# EAGLE schematic SWITCHCONTROLLER (EAGLE 9.4.2)

## Sheet 1 of 4
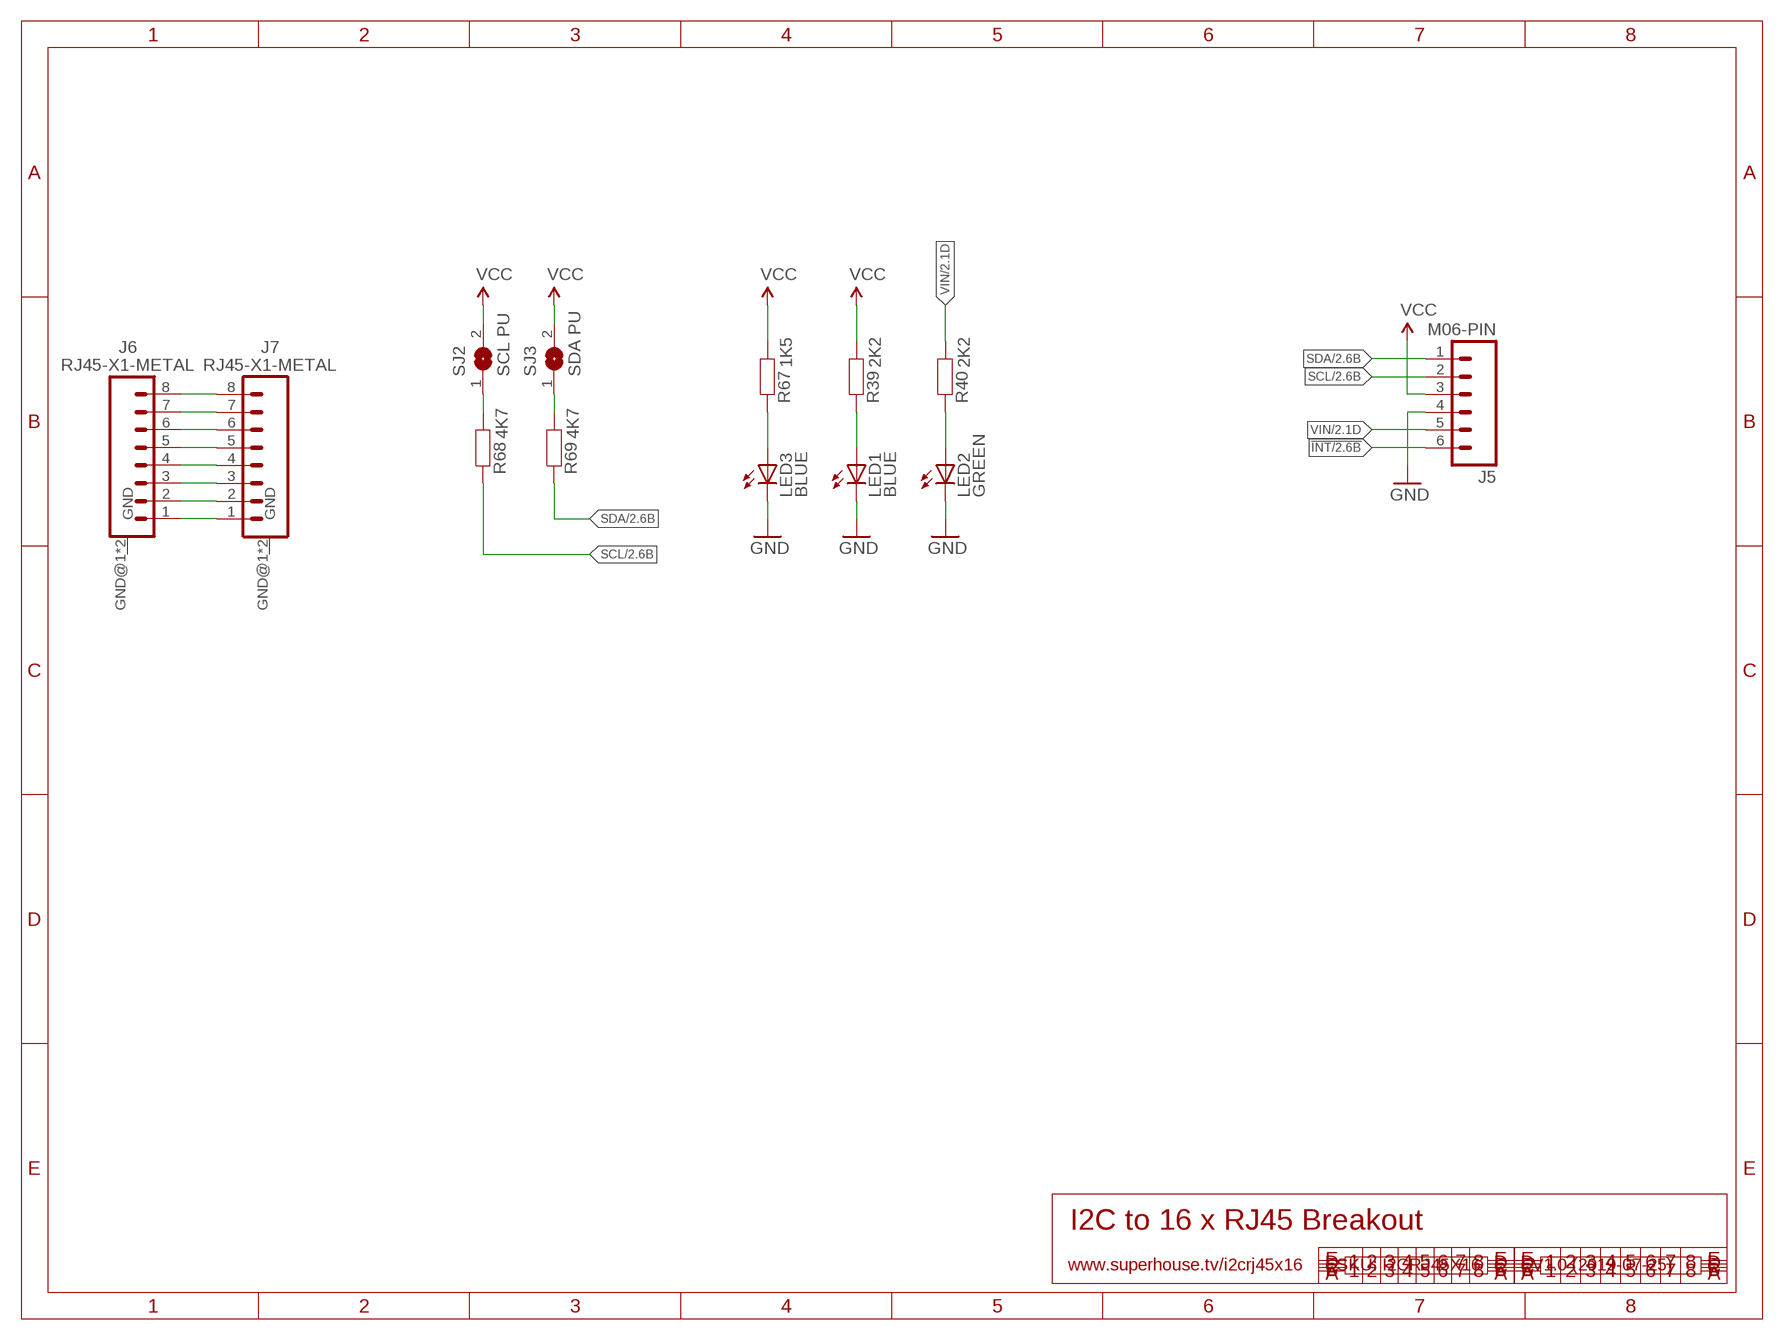
[diagram p0: schematic, sheet 1]

### Parts
J5  M06-PIN  [1X06-P]
J6  RJ45-X1-METAL  [RJ45-1X1]
J7  RJ45-X1-METAL  [RJ45-1X1]
LED1  BLUE  LED0603  [LED-0603]
LED2  GREEN  LED0603  [LED-0603]
LED3  BLUE  LED3MM  [LED3MM]
R39  2K2  RESISTOR0603  [R0603]
R40  2K2  RESISTOR0603  [R0603]
R67  1K5  RESISTOR0603  [R0603]
R68  4K7  RESISTOR0603  [R0603]
R69  4K7  RESISTOR0603  [R0603]
SJ2  SCL PU  SJ-NORMAL  [SJ]
SJ3  SDA PU  SJ-NORMAL  [SJ]

### Nets
!INT: J5.6 ; also sheet 2,3,4
GND: J5.4 LED1.C LED2.C LED3.K(C) ; also sheet 2,3,4
N$1: R68.2 SJ2.1
N$2: R69.2 SJ3.1
N$3: J6.1 J7.1
N$4: J6.2 J7.2
N$5: J6.3 J7.3
N$6: J6.4 J7.4
N$7: LED1.A R39.1
N$8: LED2.A R40.1
N$9: J6.5 J7.5
N$10: J6.6 J7.6
N$11: J6.7 J7.7
N$12: J6.8 J7.8
N$13: LED3.A R67.1
SCL: J5.2 R68.1 ; also sheet 2,3,4
SDA: J5.1 R69.1 ; also sheet 2,3,4
VCC: J5.3 R39.2 R67.2 SJ2.2 SJ3.2 ; also sheet 2,3,4
VIN: J5.5 R40.2 ; also sheet 2,3,4
Unconnected: J6.GND@1(GND) J6.GND@2(GND) J7.GND@1(GND) J7.GND@2(GND)

### Notes on the sheet
- I2C to 16 x RJ45 Breakout
- www.superhouse.tv/i2crj45x16 | SKU: I2CRJ45X16 | V1.0 (2019-07-25)

## Sheet 2 of 4
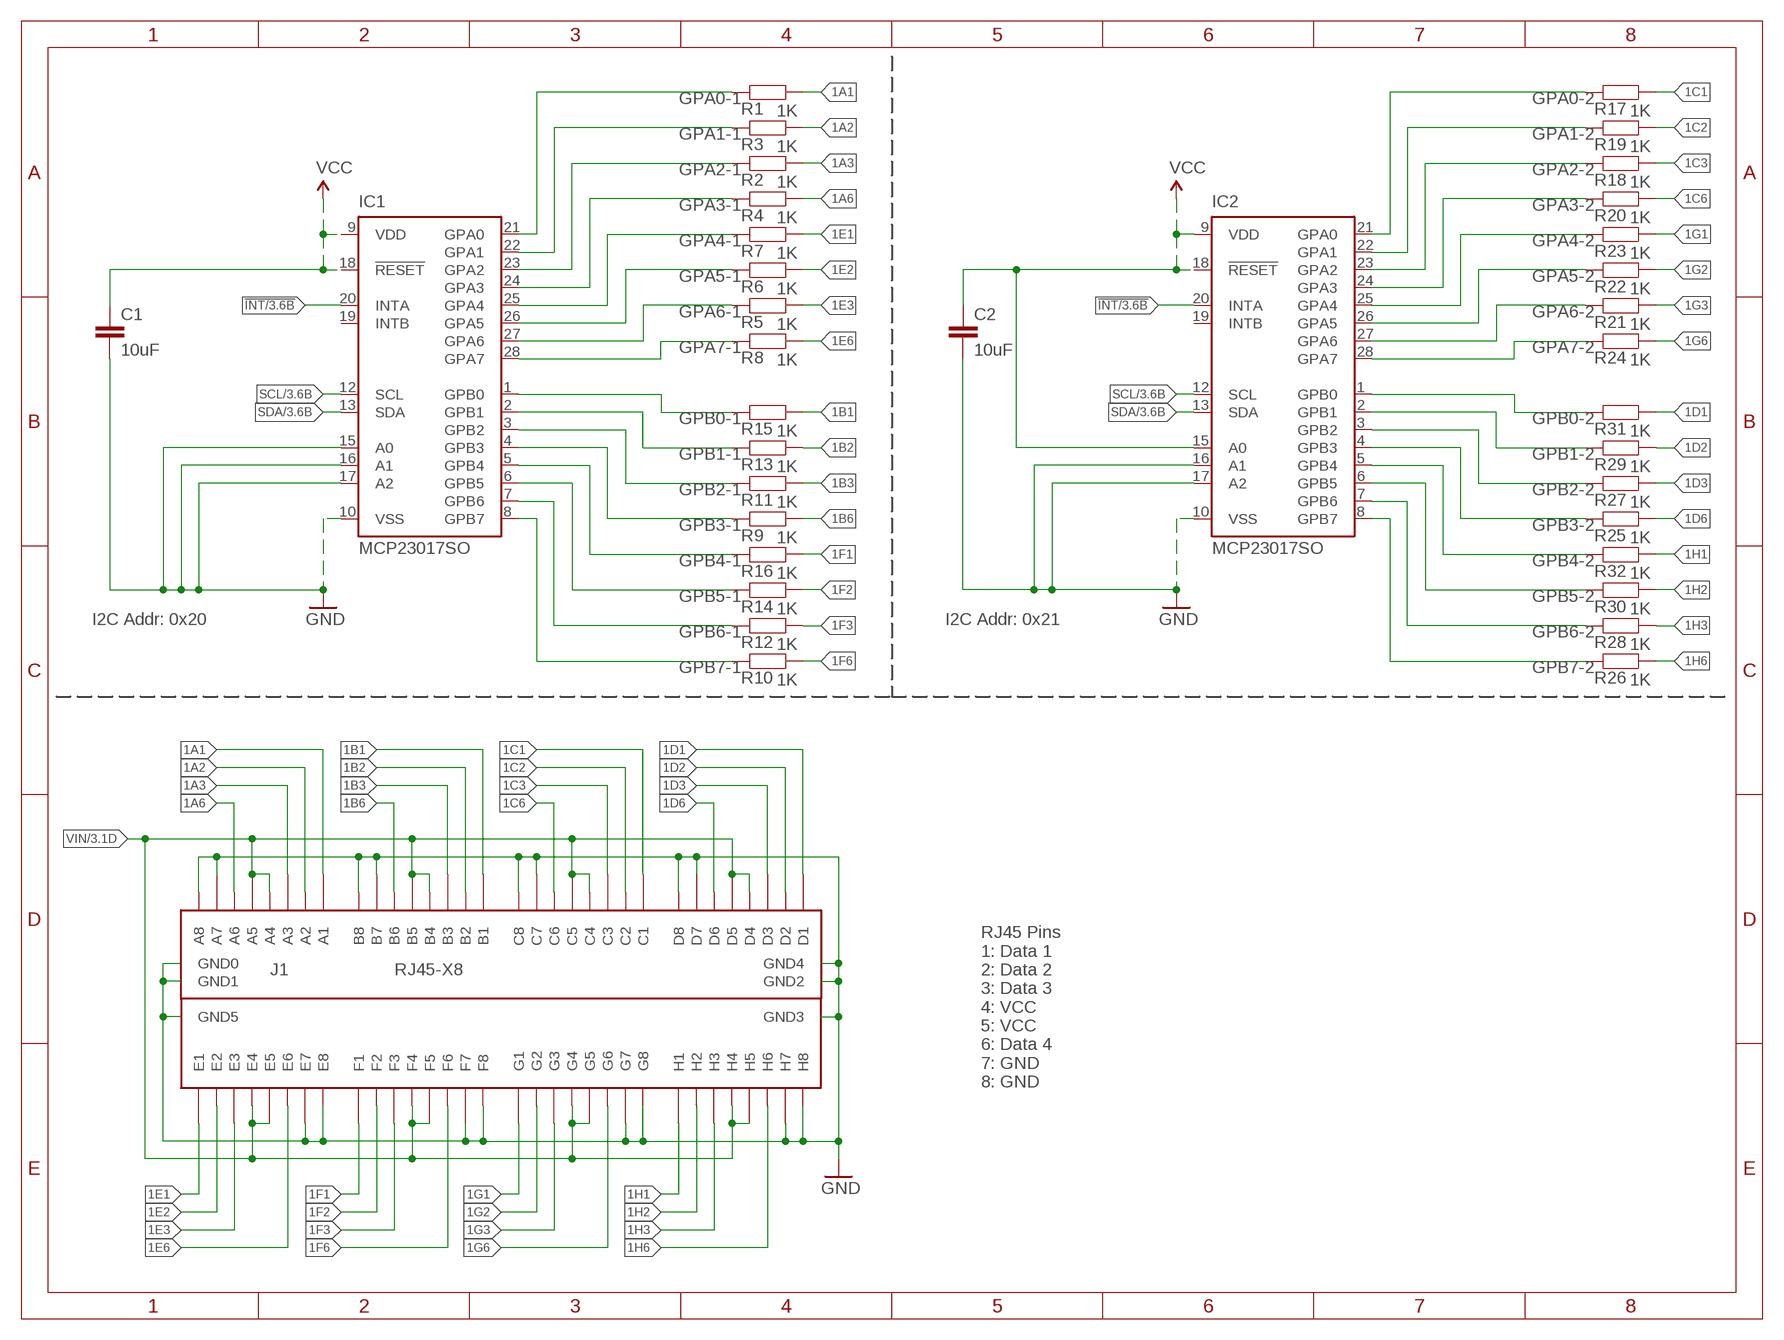
[diagram p1: schematic, sheet 2]

### Parts
C1  10uF  CAP0805  [C0805]
C2  10uF  CAP0805  [C0805]
IC1  MCP23017SO  [SO28W]
IC2  MCP23017SO  [SO28W]
J1  RJ45-X8  [RJ45-2X4]
R1  1K  RESISTOR0603  [R0603]
R2  1K  RESISTOR0603  [R0603]
R3  1K  RESISTOR0603  [R0603]
R4  1K  RESISTOR0603  [R0603]
R5  1K  RESISTOR0603  [R0603]
R6  1K  RESISTOR0603  [R0603]
R7  1K  RESISTOR0603  [R0603]
R8  1K  RESISTOR0603  [R0603]
R9  1K  RESISTOR0603  [R0603]
R10  1K  RESISTOR0603  [R0603]
R11  1K  RESISTOR0603  [R0603]
R12  1K  RESISTOR0603  [R0603]
R13  1K  RESISTOR0603  [R0603]
R14  1K  RESISTOR0603  [R0603]
R15  1K  RESISTOR0603  [R0603]
R16  1K  RESISTOR0603  [R0603]
R17  1K  RESISTOR0603  [R0603]
R18  1K  RESISTOR0603  [R0603]
R19  1K  RESISTOR0603  [R0603]
R20  1K  RESISTOR0603  [R0603]
R21  1K  RESISTOR0603  [R0603]
R22  1K  RESISTOR0603  [R0603]
R23  1K  RESISTOR0603  [R0603]
R24  1K  RESISTOR0603  [R0603]
R25  1K  RESISTOR0603  [R0603]
R26  1K  RESISTOR0603  [R0603]
R27  1K  RESISTOR0603  [R0603]
R28  1K  RESISTOR0603  [R0603]
R29  1K  RESISTOR0603  [R0603]
R30  1K  RESISTOR0603  [R0603]
R31  1K  RESISTOR0603  [R0603]
R32  1K  RESISTOR0603  [R0603]

### Nets
1A1: J1.A1 R1.2
1A2: J1.A2 R3.2
1A3: J1.A3 R2.2
1A6: J1.A6 R4.2
1B1: J1.B1 R15.2
1B2: J1.B2 R13.2
1B3: J1.B3 R11.2
1B6: J1.B6 R9.2
1C1: J1.C1 R17.2
1C2: J1.C2 R19.2
1C3: J1.C3 R18.2
1C6: J1.C6 R20.2
1D1: J1.D1 R31.2
1D2: J1.D2 R29.2
1D3: J1.D3 R27.2
1D6: J1.D6 R25.2
1E1: J1.E1 R7.2
1E2: J1.E2 R6.2
1E3: J1.E3 R5.2
1E6: J1.E6 R8.2
1F1: J1.F1 R16.2
1F2: J1.F2 R14.2
1F3: J1.F3 R12.2
1F6: J1.F6 R10.2
1G1: J1.G1 R23.2
1G2: J1.G2 R22.2
1G3: J1.G3 R21.2
1G6: J1.G6 R24.2
1H1: J1.H1 R32.2
1H2: J1.H2 R30.2
1H3: J1.H3 R28.2
1H6: J1.H6 R26.2
!INT: IC1.20(INTA) IC2.20(INTA) ; also sheet 1,3,4
GND: C1.2 C2.2 IC1.10(VSS) IC1.15(A0) IC1.16(A1) IC1.17(A2) IC2.10(VSS) IC2.16(A1) IC2.17(A2) J1.A7 J1.A8 J1.B7 J1.B8 J1.C7 J1.C8 J1.D7 J1.D8 J1.E7 J1.E8 J1.F7 J1.F8 J1.G7 J1.G8 J1.GND0 J1.GND1 J1.GND2 J1.GND3 J1.GND4 J1.GND5 J1.H7 J1.H8 ; also sheet 1,3,4
GPA0-1: IC1.21(GPA0) R1.1
GPA0-2: IC2.21(GPA0) R17.1
GPA1-1: IC1.22(GPA1) R3.1
GPA1-2: IC2.22(GPA1) R19.1
GPA2-1: IC1.23(GPA2) R2.1
GPA2-2: IC2.23(GPA2) R18.1
GPA3-1: IC1.24(GPA3) R4.1
GPA3-2: IC2.24(GPA3) R20.1
GPA4-1: IC1.25(GPA4) R7.1
GPA4-2: IC2.25(GPA4) R23.1
GPA5-1: IC1.26(GPA5) R6.1
GPA5-2: IC2.26(GPA5) R22.1
GPA6-1: IC1.27(GPA6) R5.1
GPA6-2: IC2.27(GPA6) R21.1
GPA7-1: IC1.28(GPA7) R8.1
GPA7-2: IC2.28(GPA7) R24.1
GPB0-1: IC1.1(GPB0) R15.1
GPB0-2: IC2.1(GPB0) R31.1
GPB1-1: IC1.2(GPB1) R13.1
GPB1-2: IC2.2(GPB1) R29.1
GPB2-1: IC1.3(GPB2) R11.1
GPB2-2: IC2.3(GPB2) R27.1
GPB3-1: IC1.4(GPB3) R9.1
GPB3-2: IC2.4(GPB3) R25.1
GPB4-1: IC1.5(GPB4) R16.1
GPB4-2: IC2.5(GPB4) R32.1
GPB5-1: IC1.6(GPB5) R14.1
GPB5-2: IC2.6(GPB5) R30.1
GPB6-1: IC1.7(GPB6) R12.1
GPB6-2: IC2.7(GPB6) R28.1
GPB7-1: IC1.8(GPB7) R10.1
GPB7-2: IC2.8(GPB7) R26.1
SCL: IC1.12(SCL) IC2.12(SCL) ; also sheet 1,3,4
SDA: IC1.13(SDA) IC2.13(SDA) ; also sheet 1,3,4
VCC: C1.1 C2.1 IC1.9(VDD) IC1.18(!RESET) IC2.9(VDD) IC2.15(A0) IC2.18(!RESET) ; also sheet 1,3,4
VIN: J1.A4 J1.A5 J1.B4 J1.B5 J1.C4 J1.C5 J1.D4 J1.D5 J1.E4 J1.E5 J1.F4 J1.F5 J1.G4 J1.G5 J1.H4 J1.H5 ; also sheet 1,3,4
Unconnected: IC1.19(INTB) IC2.19(INTB)

### Notes on the sheet
- I2C Addr: 0x20 | I2C Addr: 0x21
- RJ45 Pins
  1: Data 1
  2: Data 2
  3: Data 3
  4: VCC
  5: VCC
  6: Data 4
  7: GND
  8: GND

## Sheet 3 of 4
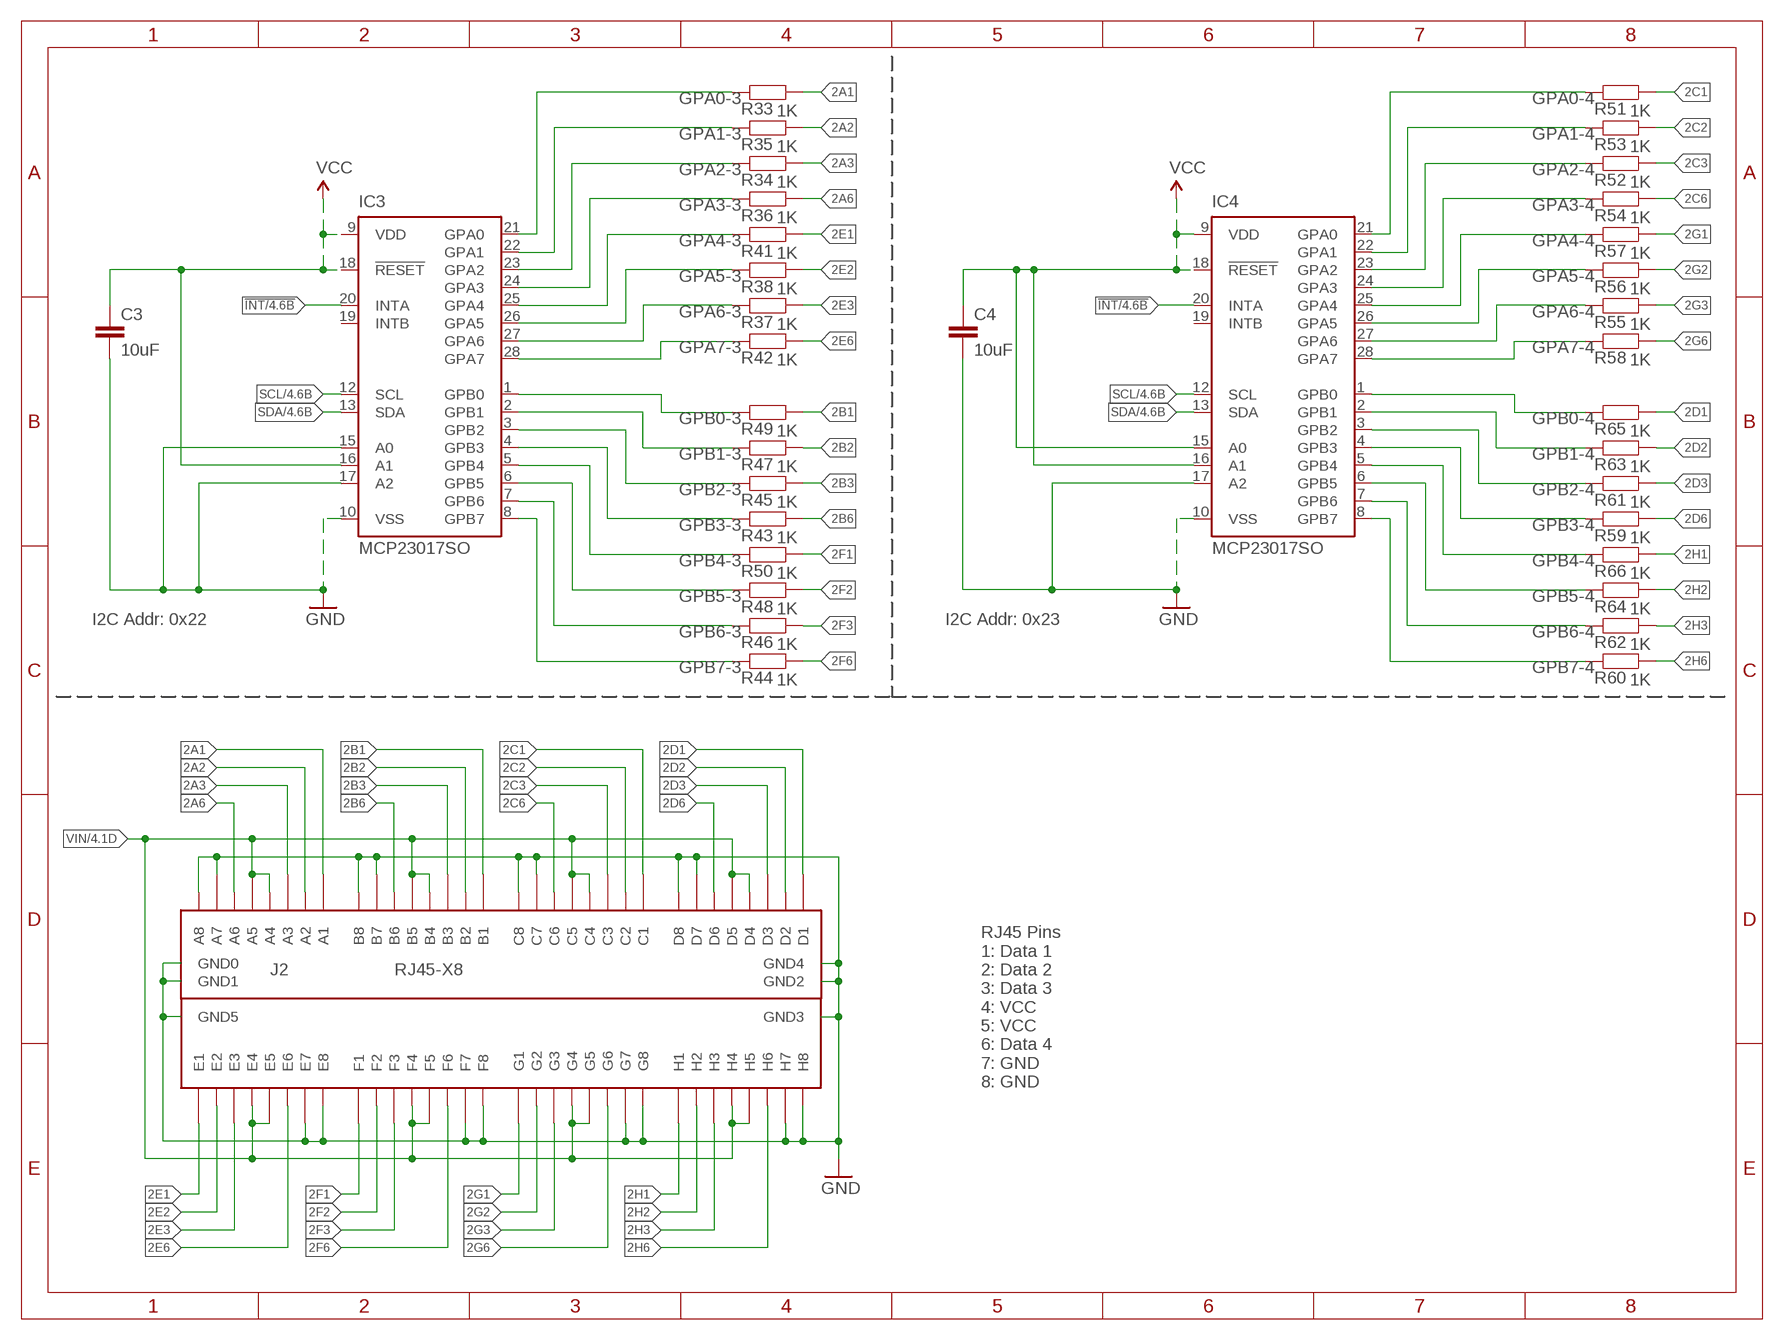
[diagram p2: schematic, sheet 3]

### Parts
C3  10uF  CAP0805  [C0805]
C4  10uF  CAP0805  [C0805]
IC3  MCP23017SO  [SO28W]
IC4  MCP23017SO  [SO28W]
J2  RJ45-X8  [RJ45-2X4]
R33  1K  RESISTOR0603  [R0603]
R34  1K  RESISTOR0603  [R0603]
R35  1K  RESISTOR0603  [R0603]
R36  1K  RESISTOR0603  [R0603]
R37  1K  RESISTOR0603  [R0603]
R38  1K  RESISTOR0603  [R0603]
R41  1K  RESISTOR0603  [R0603]
R42  1K  RESISTOR0603  [R0603]
R43  1K  RESISTOR0603  [R0603]
R44  1K  RESISTOR0603  [R0603]
R45  1K  RESISTOR0603  [R0603]
R46  1K  RESISTOR0603  [R0603]
R47  1K  RESISTOR0603  [R0603]
R48  1K  RESISTOR0603  [R0603]
R49  1K  RESISTOR0603  [R0603]
R50  1K  RESISTOR0603  [R0603]
R51  1K  RESISTOR0603  [R0603]
R52  1K  RESISTOR0603  [R0603]
R53  1K  RESISTOR0603  [R0603]
R54  1K  RESISTOR0603  [R0603]
R55  1K  RESISTOR0603  [R0603]
R56  1K  RESISTOR0603  [R0603]
R57  1K  RESISTOR0603  [R0603]
R58  1K  RESISTOR0603  [R0603]
R59  1K  RESISTOR0603  [R0603]
R60  1K  RESISTOR0603  [R0603]
R61  1K  RESISTOR0603  [R0603]
R62  1K  RESISTOR0603  [R0603]
R63  1K  RESISTOR0603  [R0603]
R64  1K  RESISTOR0603  [R0603]
R65  1K  RESISTOR0603  [R0603]
R66  1K  RESISTOR0603  [R0603]

### Nets
2A1: J2.A1 R33.2
2A2: J2.A2 R35.2
2A3: J2.A3 R34.2
2A6: J2.A6 R36.2
2B1: J2.B1 R49.2
2B2: J2.B2 R47.2
2B3: J2.B3 R45.2
2B6: J2.B6 R43.2
2C1: J2.C1 R51.2
2C2: J2.C2 R53.2
2C3: J2.C3 R52.2
2C6: J2.C6 R54.2
2D1: J2.D1 R65.2
2D2: J2.D2 R63.2
2D3: J2.D3 R61.2
2D6: J2.D6 R59.2
2E1: J2.E1 R41.2
2E2: J2.E2 R38.2
2E3: J2.E3 R37.2
2E6: J2.E6 R42.2
2F1: J2.F1 R50.2
2F2: J2.F2 R48.2
2F3: J2.F3 R46.2
2F6: J2.F6 R44.2
2G1: J2.G1 R57.2
2G2: J2.G2 R56.2
2G3: J2.G3 R55.2
2G6: J2.G6 R58.2
2H1: J2.H1 R66.2
2H2: J2.H2 R64.2
2H3: J2.H3 R62.2
2H6: J2.H6 R60.2
!INT: IC3.20(INTA) IC4.20(INTA) ; also sheet 1,2,4
GND: C3.2 C4.2 IC3.10(VSS) IC3.15(A0) IC3.17(A2) IC4.10(VSS) IC4.17(A2) J2.A7 J2.A8 J2.B7 J2.B8 J2.C7 J2.C8 J2.D7 J2.D8 J2.E7 J2.E8 J2.F7 J2.F8 J2.G7 J2.G8 J2.GND0 J2.GND1 J2.GND2 J2.GND3 J2.GND4 J2.GND5 J2.H7 J2.H8 ; also sheet 1,2,4
GPA0-3: IC3.21(GPA0) R33.1
GPA0-4: IC4.21(GPA0) R51.1
GPA1-3: IC3.22(GPA1) R35.1
GPA1-4: IC4.22(GPA1) R53.1
GPA2-3: IC3.23(GPA2) R34.1
GPA2-4: IC4.23(GPA2) R52.1
GPA3-3: IC3.24(GPA3) R36.1
GPA3-4: IC4.24(GPA3) R54.1
GPA4-3: IC3.25(GPA4) R41.1
GPA4-4: IC4.25(GPA4) R57.1
GPA5-3: IC3.26(GPA5) R38.1
GPA5-4: IC4.26(GPA5) R56.1
GPA6-3: IC3.27(GPA6) R37.1
GPA6-4: IC4.27(GPA6) R55.1
GPA7-3: IC3.28(GPA7) R42.1
GPA7-4: IC4.28(GPA7) R58.1
GPB0-3: IC3.1(GPB0) R49.1
GPB0-4: IC4.1(GPB0) R65.1
GPB1-3: IC3.2(GPB1) R47.1
GPB1-4: IC4.2(GPB1) R63.1
GPB2-3: IC3.3(GPB2) R45.1
GPB2-4: IC4.3(GPB2) R61.1
GPB3-3: IC3.4(GPB3) R43.1
GPB3-4: IC4.4(GPB3) R59.1
GPB4-3: IC3.5(GPB4) R50.1
GPB4-4: IC4.5(GPB4) R66.1
GPB5-3: IC3.6(GPB5) R48.1
GPB5-4: IC4.6(GPB5) R64.1
GPB6-3: IC3.7(GPB6) R46.1
GPB6-4: IC4.7(GPB6) R62.1
GPB7-3: IC3.8(GPB7) R44.1
GPB7-4: IC4.8(GPB7) R60.1
SCL: IC3.12(SCL) IC4.12(SCL) ; also sheet 1,2,4
SDA: IC3.13(SDA) IC4.13(SDA) ; also sheet 1,2,4
VCC: C3.1 C4.1 IC3.9(VDD) IC3.16(A1) IC3.18(!RESET) IC4.9(VDD) IC4.15(A0) IC4.16(A1) IC4.18(!RESET) ; also sheet 1,2,4
VIN: J2.A4 J2.A5 J2.B4 J2.B5 J2.C4 J2.C5 J2.D4 J2.D5 J2.E4 J2.E5 J2.F4 J2.F5 J2.G4 J2.G5 J2.H4 J2.H5 ; also sheet 1,2,4
Unconnected: IC3.19(INTB) IC4.19(INTB)

### Notes on the sheet
- I2C Addr: 0x22 | I2C Addr: 0x23
- RJ45 Pins
  1: Data 1
  2: Data 2
  3: Data 3
  4: VCC
  5: VCC
  6: Data 4
  7: GND
  8: GND

## Sheet 4 of 4
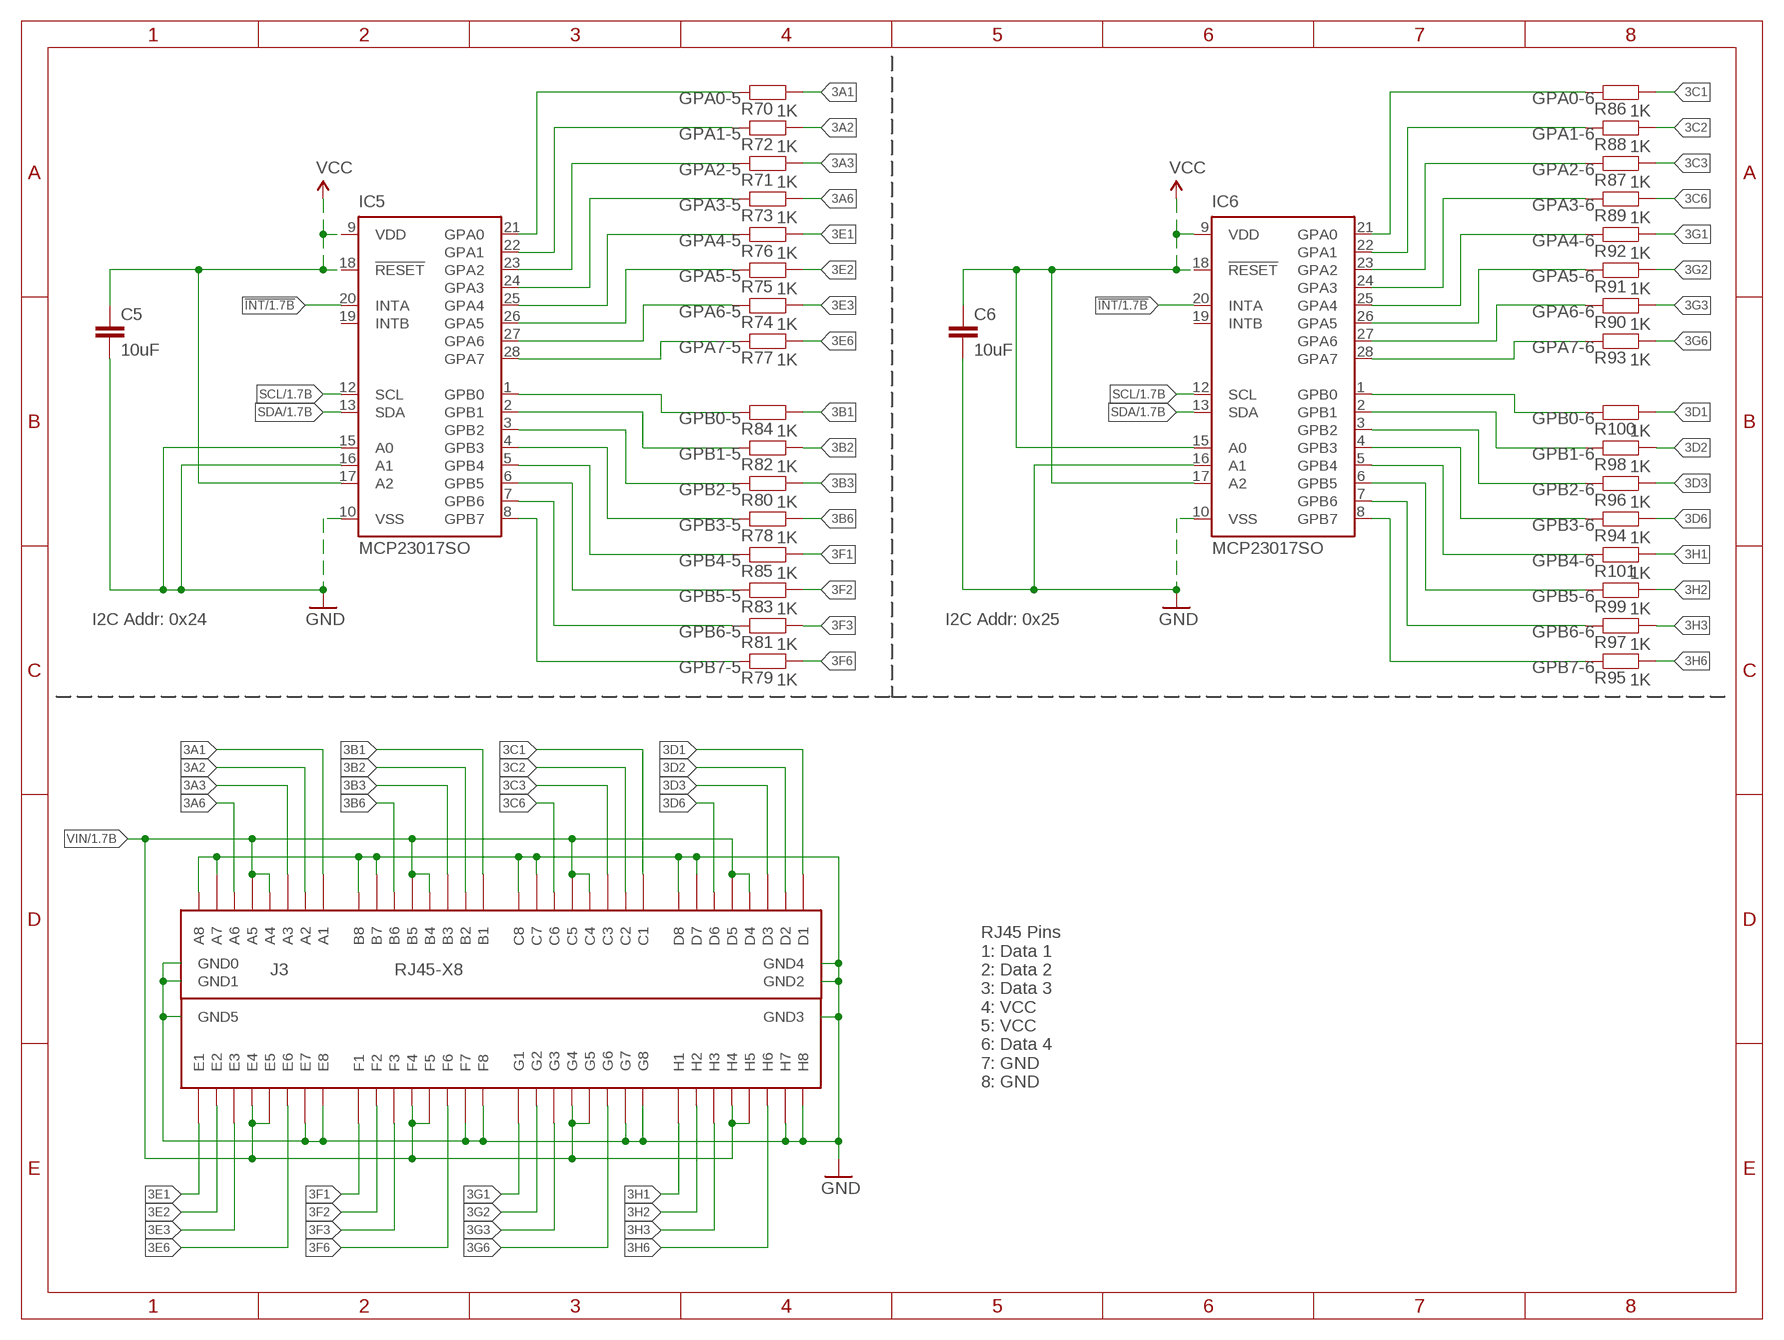
[diagram p3: schematic, sheet 4]

### Parts
C5  10uF  CAP0805  [C0805]
C6  10uF  CAP0805  [C0805]
IC5  MCP23017SO  [SO28W]
IC6  MCP23017SO  [SO28W]
J3  RJ45-X8  [RJ45-2X4]
R70  1K  RESISTOR0603  [R0603]
R71  1K  RESISTOR0603  [R0603]
R72  1K  RESISTOR0603  [R0603]
R73  1K  RESISTOR0603  [R0603]
R74  1K  RESISTOR0603  [R0603]
R75  1K  RESISTOR0603  [R0603]
R76  1K  RESISTOR0603  [R0603]
R77  1K  RESISTOR0603  [R0603]
R78  1K  RESISTOR0603  [R0603]
R79  1K  RESISTOR0603  [R0603]
R80  1K  RESISTOR0603  [R0603]
R81  1K  RESISTOR0603  [R0603]
R82  1K  RESISTOR0603  [R0603]
R83  1K  RESISTOR0603  [R0603]
R84  1K  RESISTOR0603  [R0603]
R85  1K  RESISTOR0603  [R0603]
R86  1K  RESISTOR0603  [R0603]
R87  1K  RESISTOR0603  [R0603]
R88  1K  RESISTOR0603  [R0603]
R89  1K  RESISTOR0603  [R0603]
R90  1K  RESISTOR0603  [R0603]
R91  1K  RESISTOR0603  [R0603]
R92  1K  RESISTOR0603  [R0603]
R93  1K  RESISTOR0603  [R0603]
R94  1K  RESISTOR0603  [R0603]
R95  1K  RESISTOR0603  [R0603]
R96  1K  RESISTOR0603  [R0603]
R97  1K  RESISTOR0603  [R0603]
R98  1K  RESISTOR0603  [R0603]
R99  1K  RESISTOR0603  [R0603]
R100  1K  RESISTOR0603  [R0603]
R101  1K  RESISTOR0603  [R0603]

### Nets
3A1: J3.A1 R70.2
3A2: J3.A2 R72.2
3A3: J3.A3 R71.2
3A6: J3.A6 R73.2
3B1: J3.B1 R84.2
3B2: J3.B2 R82.2
3B3: J3.B3 R80.2
3B6: J3.B6 R78.2
3C1: J3.C1 R86.2
3C2: J3.C2 R88.2
3C3: J3.C3 R87.2
3C6: J3.C6 R89.2
3D1: J3.D1 R100.2
3D2: J3.D2 R98.2
3D3: J3.D3 R96.2
3D6: J3.D6 R94.2
3E1: J3.E1 R76.2
3E2: J3.E2 R75.2
3E3: J3.E3 R74.2
3E6: J3.E6 R77.2
3F1: J3.F1 R85.2
3F2: J3.F2 R83.2
3F3: J3.F3 R81.2
3F6: J3.F6 R79.2
3G1: J3.G1 R92.2
3G2: J3.G2 R91.2
3G3: J3.G3 R90.2
3G6: J3.G6 R93.2
3H1: J3.H1 R101.2
3H2: J3.H2 R99.2
3H3: J3.H3 R97.2
3H6: J3.H6 R95.2
!INT: IC5.20(INTA) IC6.20(INTA) ; also sheet 1,2,3
GND: C5.2 C6.2 IC5.10(VSS) IC5.15(A0) IC5.16(A1) IC6.10(VSS) IC6.16(A1) J3.A7 J3.A8 J3.B7 J3.B8 J3.C7 J3.C8 J3.D7 J3.D8 J3.E7 J3.E8 J3.F7 J3.F8 J3.G7 J3.G8 J3.GND0 J3.GND1 J3.GND2 J3.GND3 J3.GND4 J3.GND5 J3.H7 J3.H8 ; also sheet 1,2,3
GPA0-5: IC5.21(GPA0) R70.1
GPA0-6: IC6.21(GPA0) R86.1
GPA1-5: IC5.22(GPA1) R72.1
GPA1-6: IC6.22(GPA1) R88.1
GPA2-5: IC5.23(GPA2) R71.1
GPA2-6: IC6.23(GPA2) R87.1
GPA3-5: IC5.24(GPA3) R73.1
GPA3-6: IC6.24(GPA3) R89.1
GPA4-5: IC5.25(GPA4) R76.1
GPA4-6: IC6.25(GPA4) R92.1
GPA5-5: IC5.26(GPA5) R75.1
GPA5-6: IC6.26(GPA5) R91.1
GPA6-5: IC5.27(GPA6) R74.1
GPA6-6: IC6.27(GPA6) R90.1
GPA7-5: IC5.28(GPA7) R77.1
GPA7-6: IC6.28(GPA7) R93.1
GPB0-5: IC5.1(GPB0) R84.1
GPB0-6: IC6.1(GPB0) R100.1
GPB1-5: IC5.2(GPB1) R82.1
GPB1-6: IC6.2(GPB1) R98.1
GPB2-5: IC5.3(GPB2) R80.1
GPB2-6: IC6.3(GPB2) R96.1
GPB3-5: IC5.4(GPB3) R78.1
GPB3-6: IC6.4(GPB3) R94.1
GPB4-5: IC5.5(GPB4) R85.1
GPB4-6: IC6.5(GPB4) R101.1
GPB5-5: IC5.6(GPB5) R83.1
GPB5-6: IC6.6(GPB5) R99.1
GPB6-5: IC5.7(GPB6) R81.1
GPB6-6: IC6.7(GPB6) R97.1
GPB7-5: IC5.8(GPB7) R79.1
GPB7-6: IC6.8(GPB7) R95.1
SCL: IC5.12(SCL) IC6.12(SCL) ; also sheet 1,2,3
SDA: IC5.13(SDA) IC6.13(SDA) ; also sheet 1,2,3
VCC: C5.1 C6.1 IC5.9(VDD) IC5.17(A2) IC5.18(!RESET) IC6.9(VDD) IC6.15(A0) IC6.17(A2) IC6.18(!RESET) ; also sheet 1,2,3
VIN: J3.A4 J3.A5 J3.B4 J3.B5 J3.C4 J3.C5 J3.D4 J3.D5 J3.E4 J3.E5 J3.F4 J3.F5 J3.G4 J3.G5 J3.H4 J3.H5 ; also sheet 1,2,3
Unconnected: IC5.19(INTB) IC6.19(INTB)

### Notes on the sheet
- I2C Addr: 0x24 | I2C Addr: 0x25
- RJ45 Pins
  1: Data 1
  2: Data 2
  3: Data 3
  4: VCC
  5: VCC
  6: Data 4
  7: GND
  8: GND

## Library data of the parts
C1-C6 = SuperHouse-DiscreteSemi:CAP: Capacitor Standard ceramic capacitor
IC1-IC6 = SuperHouse-ICs:MCP23017: http://ww1.microchip.com/downloads/en/DeviceDoc/21952a.pdf Source: http://ww1.microchip.com/downloads/en/DeviceDoc/21952a.pdf
J1-J3 = SuperHouse-Connectors:RJ45-X8: 8-way RJ45 socket, PCB mount. 2 rows of 4.
J5 = SuperHouse-Connectors:M06: 6-way header Standard 1x6 header, and screw terminal variations
J6 J7 = SuperHouse-Connectors:RJ45-X1: RJ45 socket with GND connection
LED1-LED3 = SuperHouse-LEDs:LED: LEDs Standard schematic elements and footprints for 5mm, 3mm, 1206, and 0603 sized LEDs. 5mm - Spark Fun Electronics SKU : COM-00529 (and others)
R1-R101 = SuperHouse-DiscreteSemi:RESISTOR: Resistor Standard resistors.
SJ2 SJ3 = SuperHouse-Jumpers:SJ: SMD solder jumper, normally-open. Add solder to close the connection.